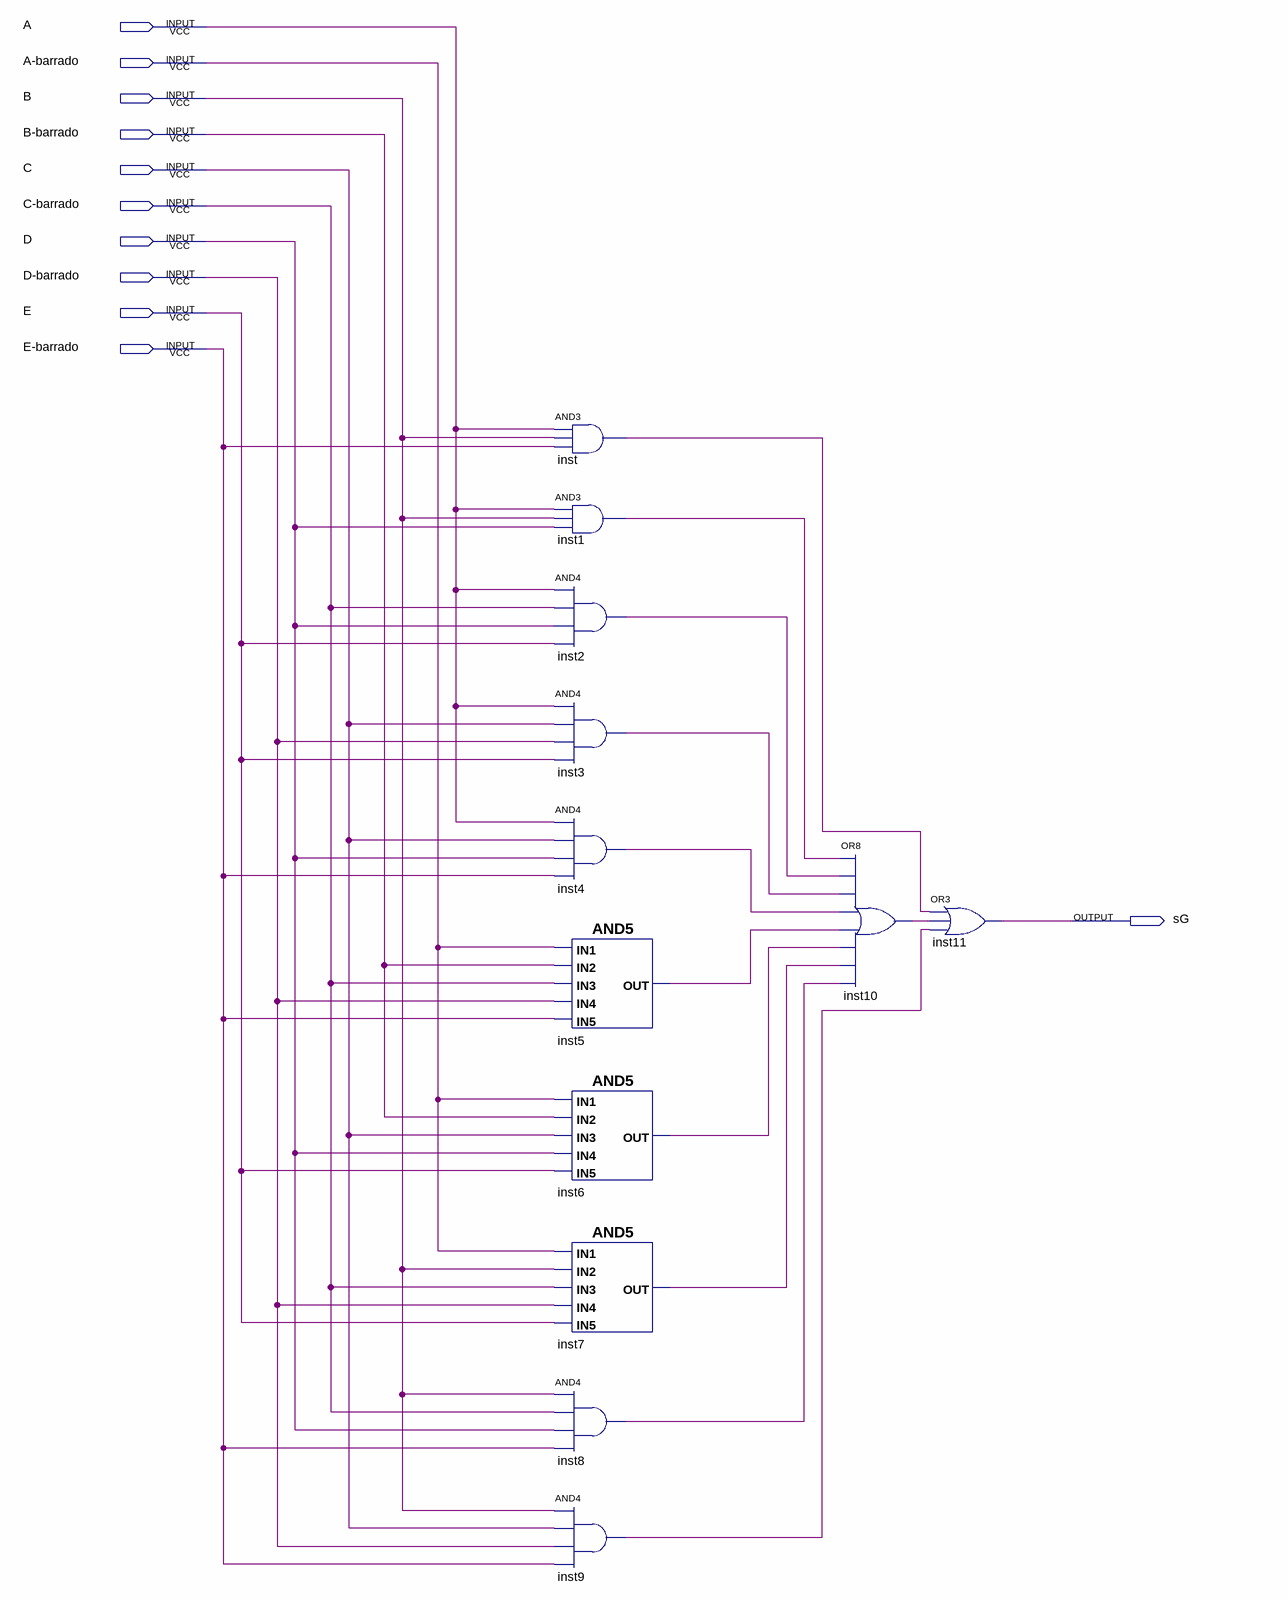
[diagram p0: schematic sheet]
// Quartus schematic saida_G.bdf as structural Verilog: 12 symbols, 11 pins
module saida_G (
  input  A,
  input  \A-barrado ,
  input  B,
  input  \B-barrado ,
  input  C,
  input  \C-barrado ,
  input  D,
  input  \D-barrado ,
  input  E,
  input  \E-barrado ,
  output sG
);

  wire inst1_out, inst2_out, inst3_out, inst4_out, inst5_out, inst6_out, inst7_out, inst8_out, inst9_out,
       inst10_out, inst_out;

  and inst (inst_out, A, B, \E-barrado );
  and inst1 (inst1_out, A, B, D);
  and inst2 (inst2_out, A, \C-barrado , D, E);
  and inst3 (inst3_out, A, C, \D-barrado , E);
  and inst4 (inst4_out, A, C, D, \E-barrado );
  and inst5 (inst5_out, \A-barrado , \B-barrado , \C-barrado , \D-barrado , \E-barrado );
  and inst6 (inst6_out, \A-barrado , \B-barrado , C, D, E);
  and inst7 (inst7_out, \A-barrado , B, \C-barrado , \D-barrado , E);
  and inst8 (inst8_out, B, \C-barrado , D, \E-barrado );
  and inst9 (inst9_out, B, C, \D-barrado , \E-barrado );
  or inst10 (inst10_out, inst1_out, inst2_out, inst3_out, inst4_out, inst5_out, inst6_out, inst7_out, inst8_out);
  or inst11 (sG, inst_out, inst10_out, inst9_out);
endmodule
